# Altium project PUA.PrjPcb (part 3 of 14)

## Sheet Public_CPU_Reset_IO.SchDoc
size D
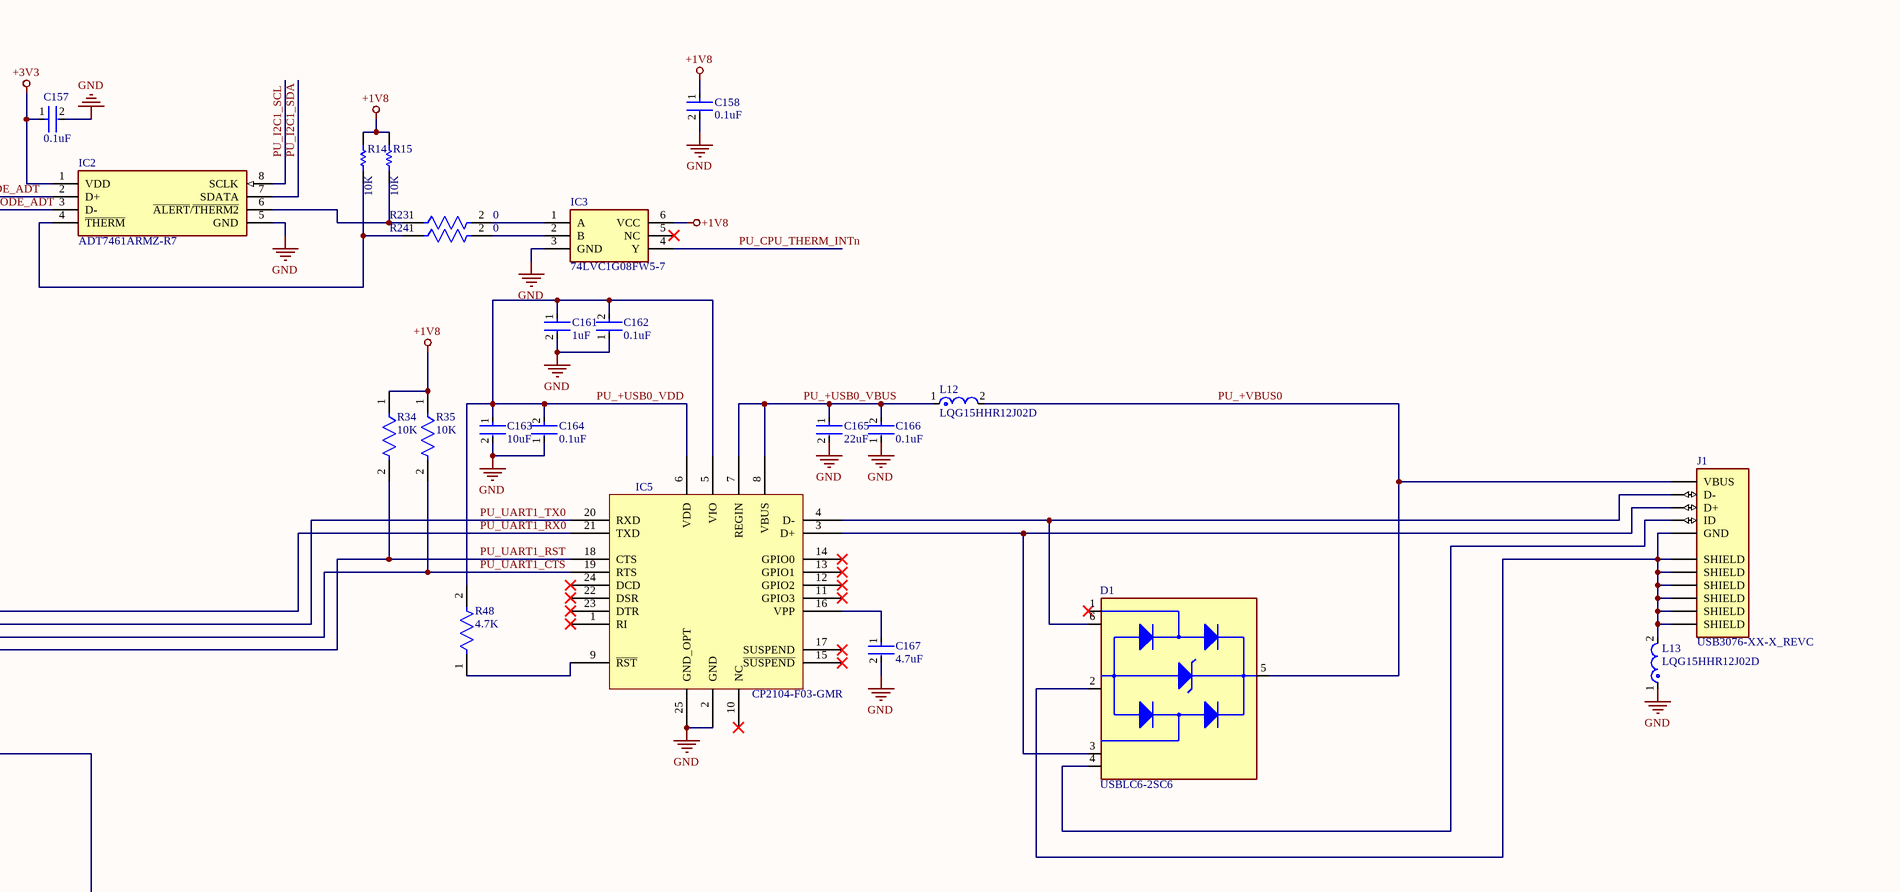
[diagram p8: Public_CPU_Reset_IO.SchDoc, top right]
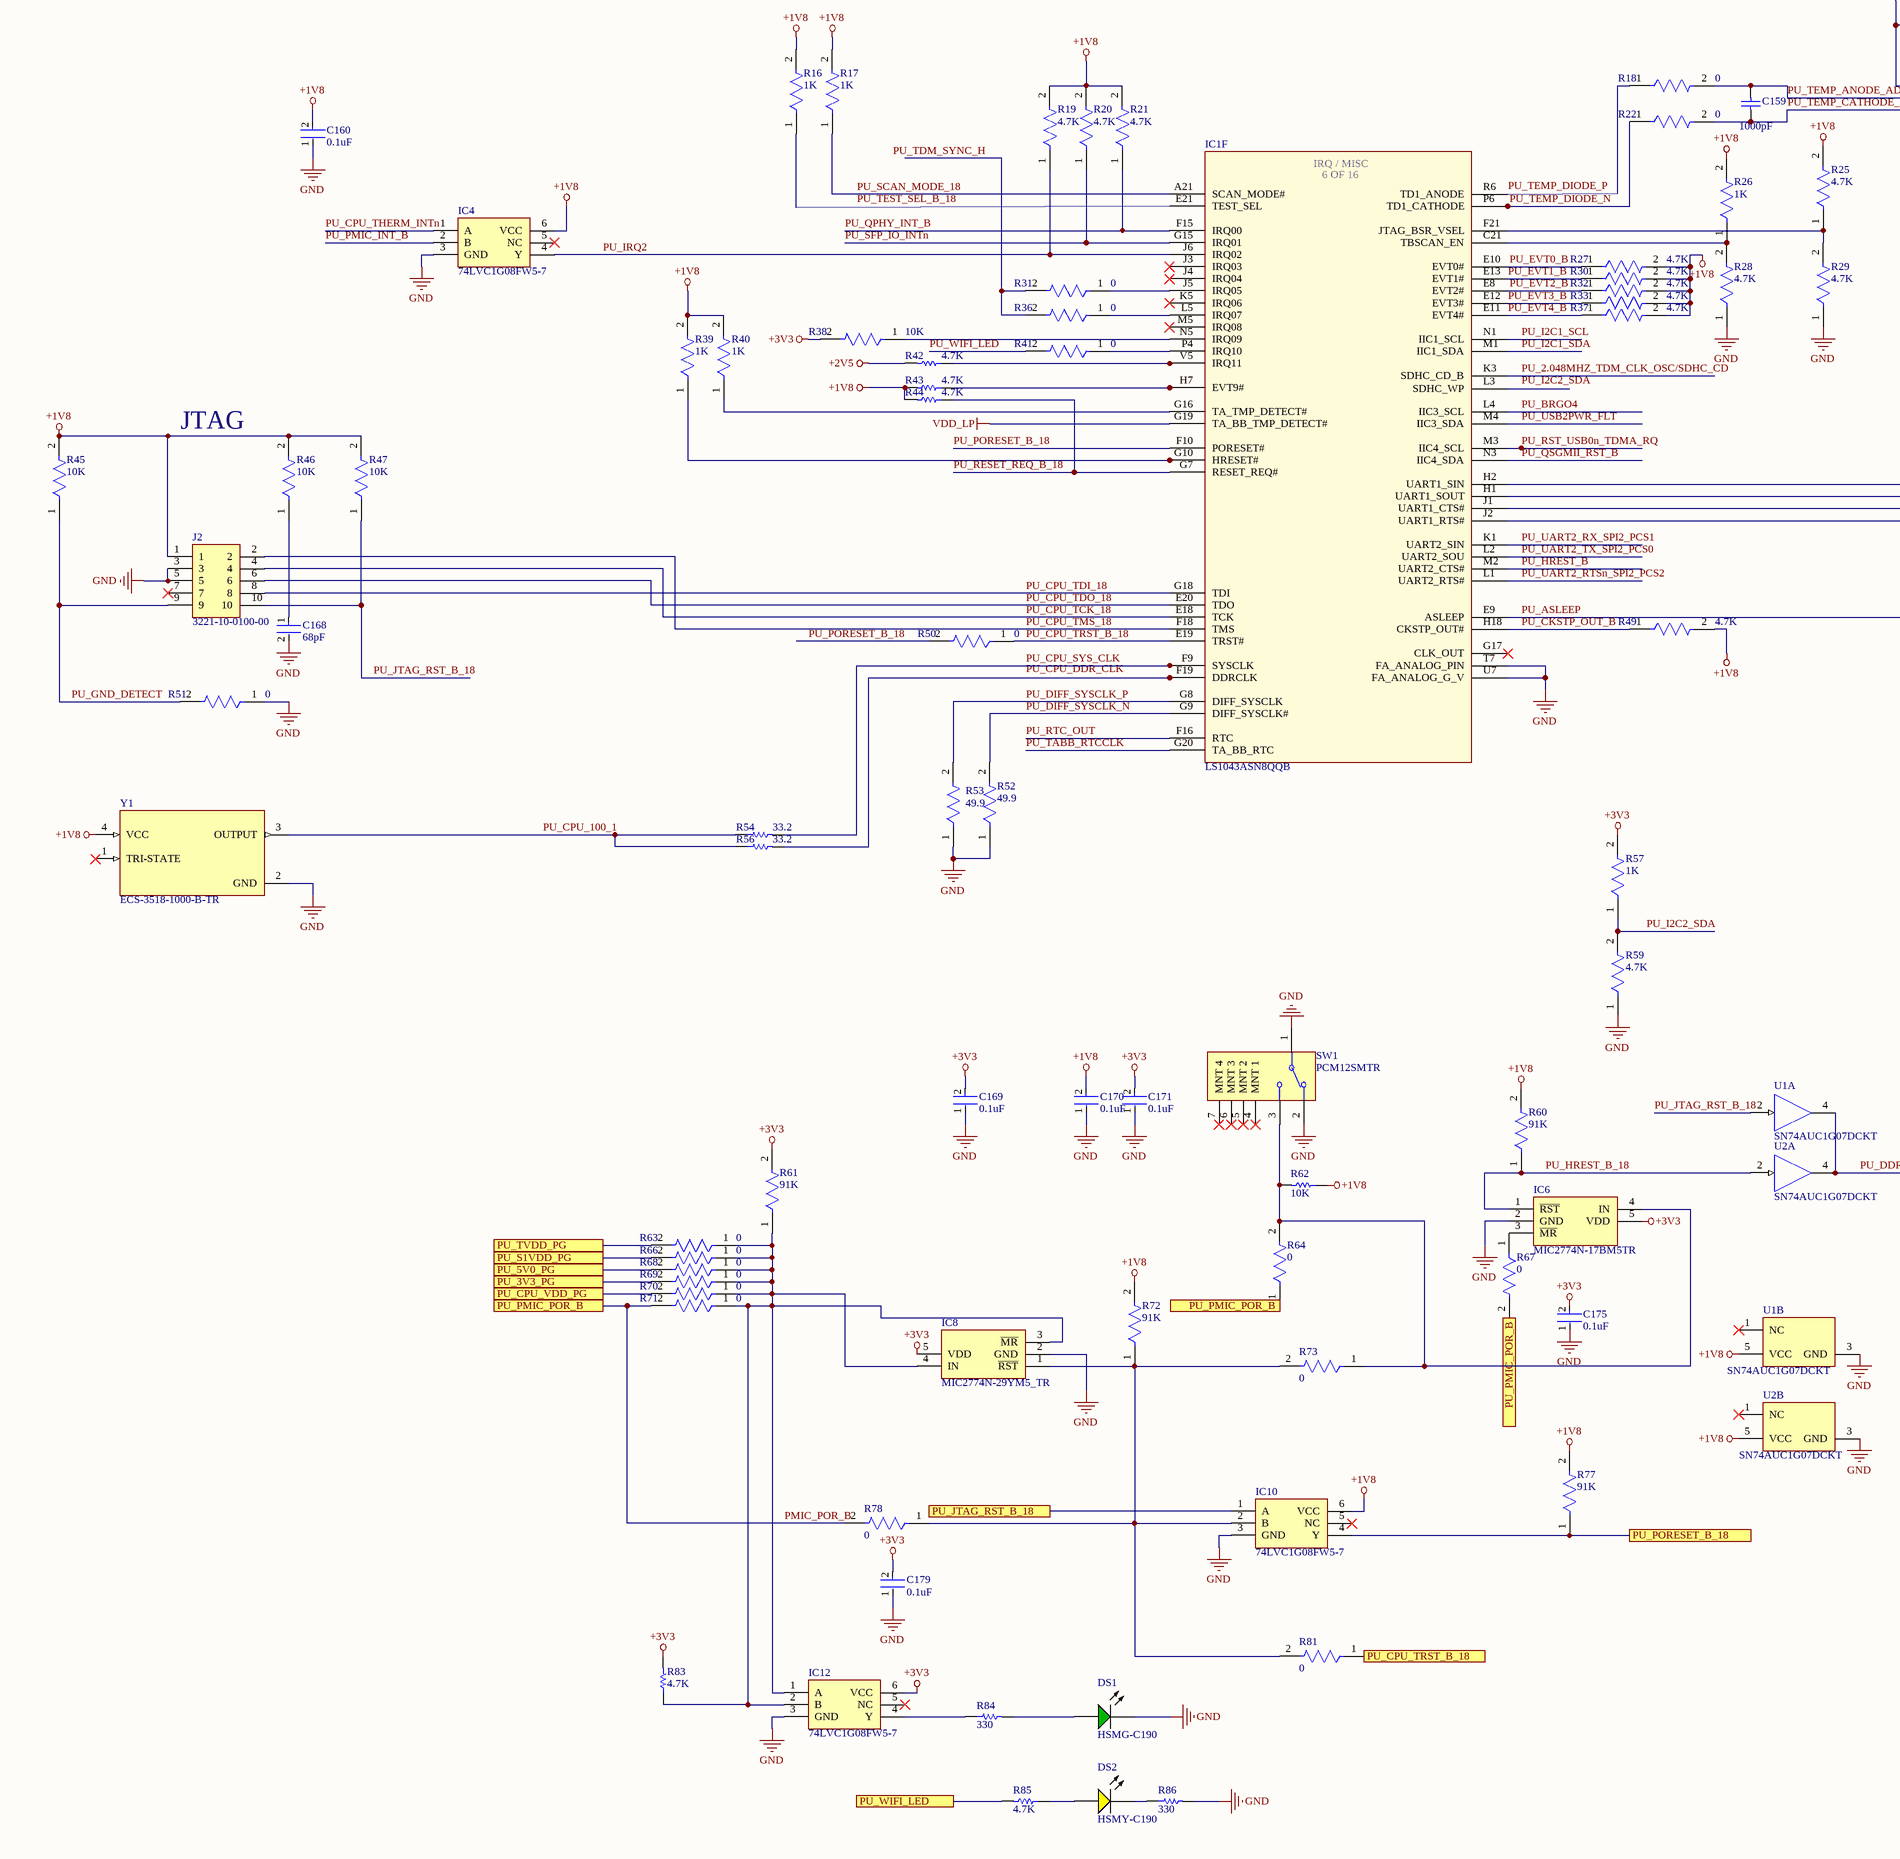
[diagram p9: Public_CPU_Reset_IO.SchDoc, bottom left]
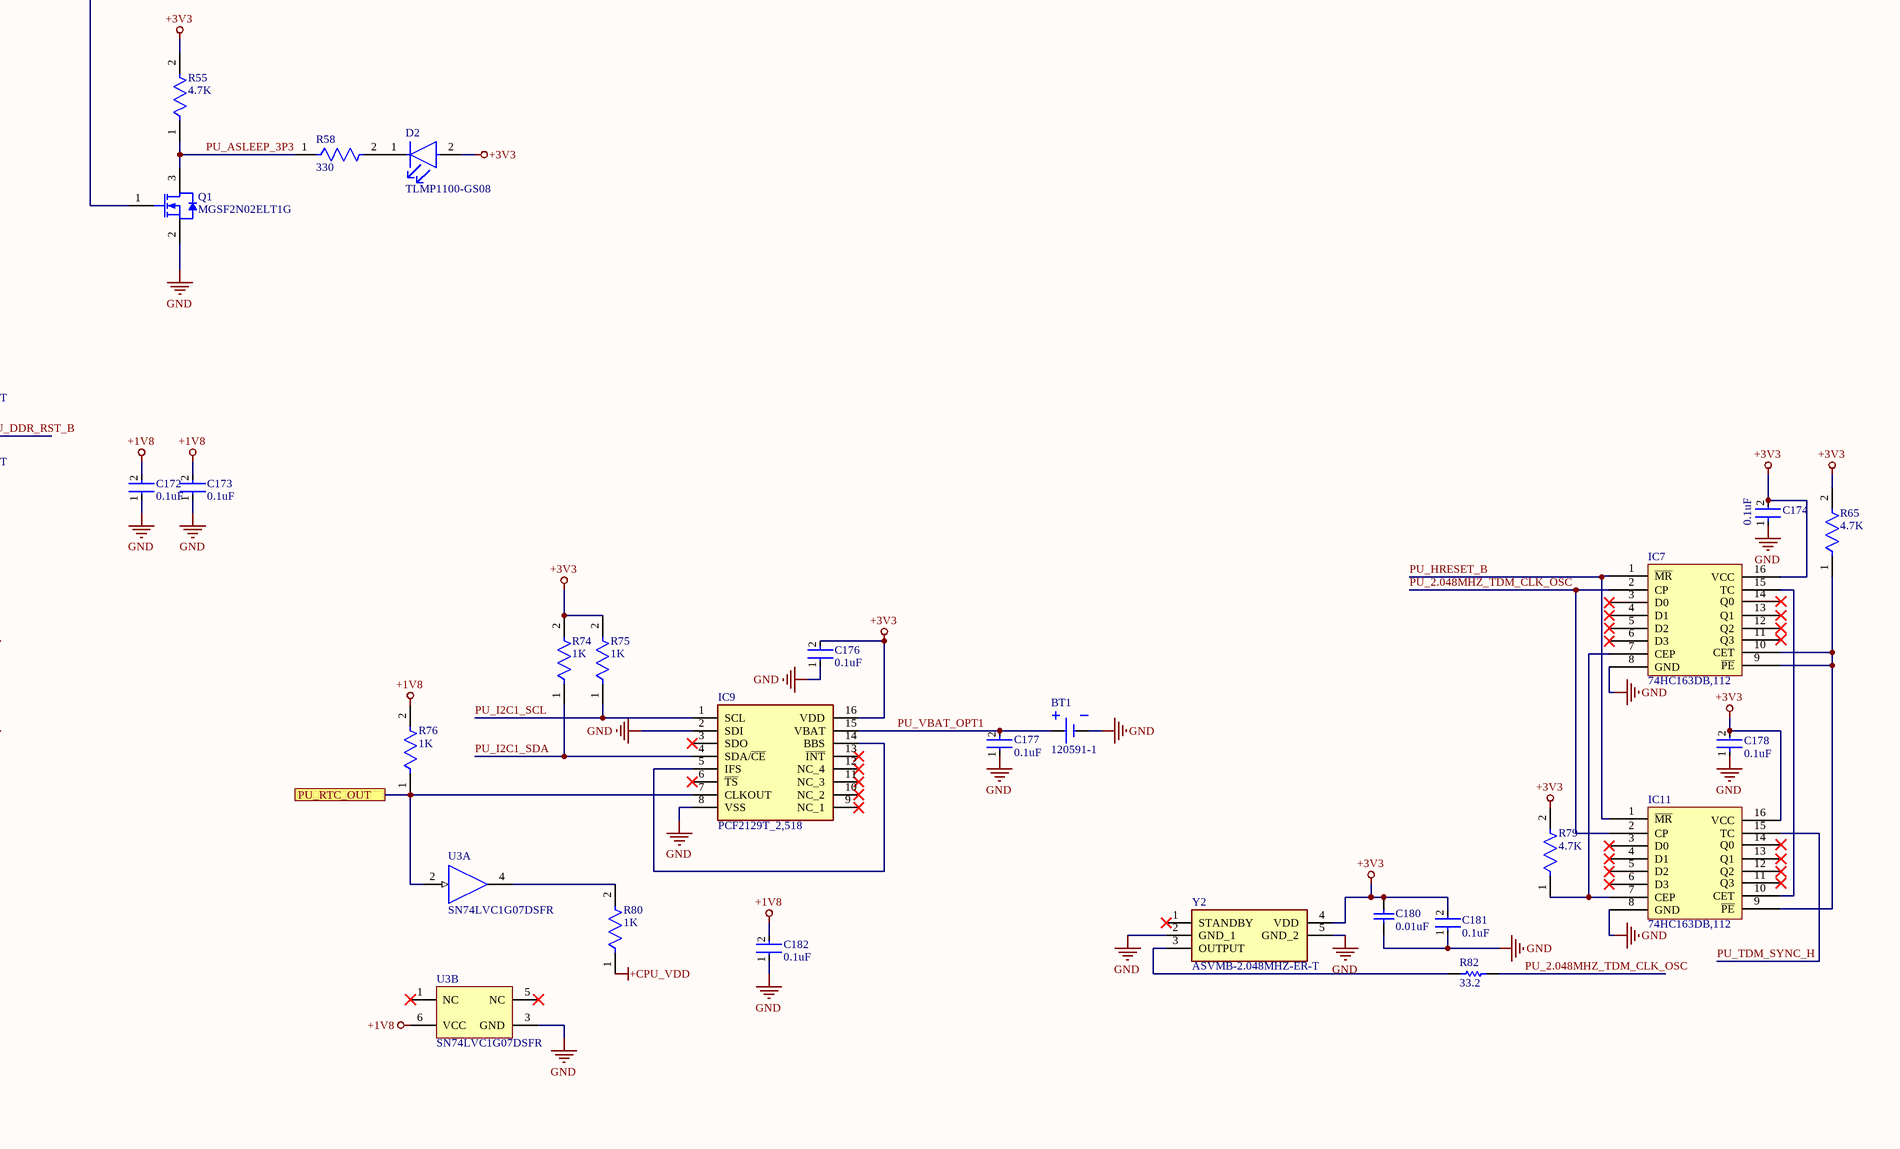
[diagram p10: Public_CPU_Reset_IO.SchDoc, bottom right]

### Parts
BT1  120591-1  [TECO-120591-1-2_V]
C157  0.1uF  [FP-C0402-BB-MFG]
C158  0.1uF  [FP-C0402-BB-MFG]
C159  1000pF  [CAPC1005X55X25ML5T10]
C160  0.1uF  [FP-GRM15-MFG]
C161  1uF  [FP-GRM15-0_1-MFG]
C162  0.1uF  [FP-GRM15-MFG]
C163  10uF  [FP-C0805C-DG-MFG]
C164  0.1uF  [FP-GRM15-MFG]
C165  22uF  [FP-GRM21B-0_15-MFG]
C166  0.1uF  [FP-GRM15-MFG]
C167  4.7uF  [FP-GRM155-0_1-IPC_B]
C168  68pF  [FP-C0805C-DN-MFG]
C169  0.1uF  [FP-GRM15-MFG]
C170  0.1uF  [FP-GRM15-MFG]
C171  0.1uF  [FP-GRM15-MFG]
C172  0.1uF  [FP-GRM15-MFG]
C173  0.1uF  [FP-GRM15-MFG]
C174  0.1uF  [FP-C0402-BB-MFG]
C175  0.1uF  [FP-GRM15-MFG]
C176  0.1uF  [FP-GRM15-MFG]
C177  0.1uF  [FP-GRM15-MFG]
C178  0.1uF  [FP-C0402-BB-MFG]
C179  0.1uF  [FP-GRM15-MFG]
C180  0.01uF  [CAPC1005X56X25LL10T15]
C181  0.1uF  [FP-C0402-BB-MFG]
C182  0.1uF  [FP-GRM15-MFG]
D1  USBLC6-2SC6  [SOT95P280X145-6N]
D2  TLMP1100-GS08  [FP-6_541-5056_01-4-MFG]
DS1  HSMG-C190  [AVAG-HSMX-C190_V]
DS2  HSMY-C190  [AVAG-HSMX-C190_V]
IC1  LS1043ASN8QQB  [BGA780C80P28X28_2300X2300X261]  (part F of 16)
IC2  ADT7461ARMZ-R7  [SOP65P490X110-8N]
IC3  74LVC1G08FW5-7  [74LVC1G08FW57]
IC4  74LVC1G08FW5-7  [74LVC1G08FW57]
IC5  CP2104-F03-GMR  [QFN50P400X400X80-25N-D]
IC6  MIC2774N-17BM5TR  [SOT95P280X145-5N]
IC7  74HC163DB,112  [SOP65P775X200-16N]
IC8  MIC2774N-29YM5_TR  [SOT95P280X145-5N]
IC9  PCF2129T_2,518  [SOIC127P1032X265-16N]
IC10  74LVC1G08FW5-7  [74LVC1G08FW57]
IC11  74HC163DB,112  [SOP65P775X200-16N]
IC12  74LVC1G08FW5-7  [74LVC1G08FW57]
J1  USB3076-XX-X_REVC  [GCT_USB3076-XX-X_REVC]
J2  3221-10-0100-00  [CNC_3221-10-0100-00]
L12  LQG15HHR12J02D  [FP-LQG15HH_02-IPC_B]
L13  LQG15HHR12J02D  [FP-LQG15HH_02-IPC_B]
Q1  MGSF2N02ELT1G  [ONSC-SOT-23-3-318-08_V]
R14  10K  [RESC1005X40X25NL05T05]
R15  10K  [RESC1005X40X25NL05T05]
R16  1K  [FP-CRCW0402-e3-MFG]
R17  1K  [FP-CRCW0402-e3-MFG]
R18  0  [FP-CRCW0402-e3-IPC_C]
R19  4.7K  [FP-CRCW0402-e3-IPC_B]
R20  4.7K  [FP-CRCW0402-e3-IPC_B]
R21  4.7K  [FP-CRCW0402-e3-IPC_B]
R22  0  [FP-CRCW0402-e3-IPC_C]
R23  0  [FP-CRCW0402-e3-IPC_C]
R24  0  [FP-CRCW0402-e3-IPC_C]
R25  4.7K  [FP-CRCW0402-e3-IPC_B]
R26  1K  [FP-CRCW0402-e3-MFG]
R27  4.7K  [FP-CRCW0402-e3-IPC_B]
R28  4.7K  [FP-CRCW0402-e3-IPC_B]
R29  4.7K  [FP-CRCW0402-e3-IPC_B]
R30  4.7K  [FP-CRCW0402-e3-IPC_B]
R31  0  [FP-CRCW0402-e3-IPC_C]
R32  4.7K  [FP-CRCW0402-e3-IPC_B]
R33  4.7K  [FP-CRCW0402-e3-IPC_B]
R34  10K  [FP-CRCW0402-e3-IPC_B]
R35  10K  [FP-CRCW0402-e3-IPC_B]
R36  0  [FP-CRCW0402-e3-IPC_C]
R37  4.7K  [FP-CRCW0402-e3-IPC_B]
R38  10K  [FP-CRCW0402-e3-IPC_B]
R39  1K  [FP-CRCW0402-e3-MFG]
R40  1K  [FP-CRCW0402-e3-MFG]
R41  0  [FP-CRCW0402-e3-IPC_C]
R42  4.7K  [RESC1005X40X25LL05T05]
R43  4.7K  [RESC1005X40X25LL05T05]
R44  4.7K  [RESC1005X40X25LL05T05]
R45  10K  [FP-CRCW0402-e3-IPC_B]
R46  10K  [FP-CRCW0402-e3-IPC_B]
R47  10K  [FP-CRCW0402-e3-IPC_B]
R48  4.7K  [FP-CRCW0402-e3-IPC_B]
R49  4.7K  [FP-CRCW0402-e3-IPC_B]
R50  0  [FP-CRCW0402-e3-IPC_C]
R51  0  [FP-CRCW0402-e3-IPC_C]
R52  49.9  [FP-CRCW0402-e3-MFG]
R53  49.9  [FP-CRCW0402-e3-MFG]
R54  33.2  [RESC1005X40X25LL05T05]
R55  4.7K  [FP-CRCW0402-e3-IPC_B]
R56  33.2  [RESC1005X40X25LL05T05]
R57  1K  [FP-CRCW0402-e3-MFG]
R58  330  [FP-CRCW0402-e3-MFG]
R59  4.7K  [FP-CRCW0402-e3-IPC_B]
R60  91K  [FP-CRCW0402-e3-IPC_B]
R61  91K  [FP-CRCW0402-e3-IPC_B]
R62  10K  [RESC1005X40X25NL05T05]
R63  0  [FP-CRCW0402-e3-IPC_C]
R64  0  [FP-CRCW0402-e3-IPC_C]
R65  4.7K  [FP-CRCW0402-e3-IPC_B]
R66  0  [FP-CRCW0402-e3-IPC_C]
R67  0  [FP-CRCW0402-e3-IPC_C]
R68  0  [FP-CRCW0402-e3-IPC_C]
R69  0  [FP-CRCW0402-e3-IPC_C]
R70  0  [FP-CRCW0402-e3-IPC_C]
R71  0  [FP-CRCW0402-e3-IPC_C]
R72  91K  [FP-CRCW0402-e3-IPC_B]
R73  0  [FP-CRCW0402-e3-IPC_C]
R74  1K  [FP-CRCW0402-e3-MFG]
R75  1K  [FP-CRCW0402-e3-MFG]
R76  1K  [FP-CRCW0402-e3-MFG]
R77  91K  [FP-CRCW0402-e3-IPC_B]
R78  0  [FP-CRCW0402-e3-IPC_C]
R79  4.7K  [FP-CRCW0402-e3-IPC_B]
R80  1K  [FP-CRCW0402-e3-MFG]
R81  0  [FP-CRCW0402-e3-IPC_C]
R82  33.2  [RESC1005X40X25ML05T05]
R83  4.7K  [RESC1005X40X25LL05T05]
R84  330  [RESC1608X55X30LL15T15]
R85  4.7K  [RESC1005X40X25LL05T05]
R86  330  [RESC1608X55X30LL15T15]
SW1  PCM12SMTR  [FP-PCM12SMTR-MFG]
U1  SN74AUC1G07DCKT  [DCK0005A_M]  (parts A,B of 2)
U2  SN74AUC1G07DCKT  [DCK0005A_M]  (parts A,B of 2)
U3  SN74LVC1G07DSFR  [DSF0006A_V]  (parts A,B of 2)
Y1  ECS-3518-1000-B-TR  [OSC_ECS-3518-1000-B-TR]
Y2  ASVMB-2.048MHZ-ER-T  [ASVMB2048MHZERT]

### Ports
PU_3V3_PG, PU_5V0_PG, PU_CPU_TRST_B_18, PU_CPU_VDD_PG, PU_JTAG_RST_B_18, PU_PMIC_POR_B, PU_PORESET_B_18, PU_RTC_OUT, PU_S1VDD_PG, PU_TVDD_PG, PU_WIFI_LED

### Nets
+1V8: C158.1 C160.2 C170.2 C172.2 C173.2 C182.2 IC3.6(VCC) IC4.6(VCC) IC10.6(VCC) J2.1 R14.2 R15.2 R16.2 R17.2 R19.2 R20.2 R21.2 R25.2 R26.2 R27.2 R30.2 R32.2 R33.2 R34.1 R35.1 R37.2 R39.2 R40.2 R43.2 R44.2 R45.2 R46.2 R47.2 R49.2 R60.2 R62.1 R72.2 R76.2 R77.2 U1.5(VCC) U2.5(VCC) U3.6(VCC) Y1.4(VCC)
+2V5: R42.2
+3V3: C157.1 C169.2 C171.2 C174.2 C175.2 C176.2 C178.2 C179.2 C180.2 C181.2 D2.2(A) IC2.1(VDD) IC6.5(VDD) IC7.16(VCC) IC8.5(VDD) IC9.16(VDD) IC11.16(VCC) IC12.6(VCC) R38.2 R55.2 R57.2 R61.2 R65.2 R74.2 R75.2 R79.2 R83.2 Y2.4(VDD)
+CPU_VDD: R80.1
GND: BT1.2(-) C157.2 C158.2 C160.1 C161.2 C162.1 C163.2 C164.1 C165.2 C166.1 C167.2 C168.2 C169.1 C170.1 C171.1 C172.1 C173.1 C174.1 C175.1 C176.1 C177.1 C178.1 C179.1 C180.1 C181.1 C182.1 DS1.2(K) IC1.T7(FA_ANALOG_PIN) IC1.U7(FA_ANALOG_G_V) IC2.5(GND) IC3.3(GND) IC4.3(GND) IC5.2(GND) IC5.25(GND_OPT) IC6.2(GND) IC7.8(GND) IC8.2(GND) IC9.2(SDI) IC9.8(VSS) IC10.3(GND) IC11.8(GND) IC12.3(GND) J2.3 J2.5 L13.1 Q1.2(S) R28.1 R29.1 R51.1 R52.1 R53.1 R59.1 R86.2 SW1.1 SW1.2 U1.3(GND) U2.3(GND) U3.3(GND) Y1.2(GND) Y2.2(GND_1) Y2.5(GND_2)
VDD_LP: IC1.G19(TA_BB_TMP_DETECT#)
PMIC_POR_B: R64.1 R67.2 R71.2 R78.2 ; port PU_PMIC_POR_B
PU_2.048MHZ_TDM_CLK_OSC: IC7.2(CP) IC11.2(CP) R82.2
PU_2.048MHZ_TDM_CLK_OSC/SDHC_CD: IC1.K3(SDHC_CD_B)
PU_+USB0_VBUS: C165.1 C166.2 IC5.7(REGIN) IC5.8(VBUS) L12.1
PU_+USB0_VDD: C161.1 C162.2 C163.1 C164.2 IC5.5(VIO) IC5.6(VDD) R48.2
PU_+VBUS0: D1.5(VBUS) J1.1(VBUS) L12.2
PU_ASLEEP: IC1.E9(ASLEEP) Q1.1(G)
PU_ASLEEP_3P3: Q1.3(D) R55.1 R58.1
PU_BRGO4: IC1.L4(IIC3_SCL)
PU_CKSTP_OUT_B: IC1.H18(CKSTP_OUT#) R49.1
PU_CPU_100_1: R54.1 R56.1 Y1.3(OUTPUT)
PU_CPU_SYS_CLK: IC1.F9(SYSCLK) R54.2
PU_CPU_TCK_18: IC1.E18(TCK) J2.4
PU_CPU_TDI_18: IC1.G18(TDI) J2.8
PU_CPU_TDO_18: IC1.E20(TDO) J2.6
PU_CPU_THERM_INTn: IC3.4(Y) IC4.1(A)
PU_CPU_TMS_18: IC1.F18(TMS) J2.2
PU_CPU_TRST_B_18: IC1.E19(TRST#) R50.1
PU_DDR_RST_B: U1.4(Y) U2.4(Y)
PU_DIFF_SYSCLK_N: IC1.G9(DIFF_SYSCLK#) R52.2
PU_DIFF_SYSCLK_P: IC1.G8(DIFF_SYSCLK) R53.2
PU_EVT0_B: IC1.E10(EVT0#) R27.1
PU_EVT1_B: IC1.E13(EVT1#) R30.1
PU_EVT2_B: IC1.E8(EVT2#) R32.1
PU_EVT3_B: IC1.E12(EVT3#) R33.1
PU_EVT4_B: IC1.E11(EVT4#) R37.1
PU_GND_DETECT: J2.9 R45.1 R51.2
PU_HRESET_B: IC7.1(~{MR}) IC11.1(~{MR})
PU_HREST_B: IC1.M2(UART2_CTS#)
PU_HREST_B_18: IC6.1(~{RST}) R60.1 U2.2(A)
PU_I2C1_SCL: IC1.N1(IIC1_SCL) IC2.8(SCLK) IC9.1(SCL) R75.1
PU_I2C1_SDA: IC1.M1(IIC1_SDA) IC2.7(SDATA) IC9.4(SDA/~{CE}) R74.1
PU_I2C2_SDA: R57.1 R59.2
PU_IRQ2: IC1.J6(IRQ02) IC4.4(Y) R19.1
PU_JTAG_RST_B_18: J2.10 R47.1 U1.2(A)
PU_PMIC_INT_B: IC4.2(B)
PU_PORESET_B_18: IC1.F10(PORESET#) R50.2
PU_QPHY_INT_B: IC1.F15(IRQ00) R21.1
PU_QSGMII_RST_B: IC1.N3(IIC4_SDA)
PU_RESET_REQ_B_18: IC1.G7(RESET_REQ#) R44.1
PU_RST_USB0n_TDMA_RQ: IC1.M3(IIC4_SCL)
PU_RTC_OUT: IC1.F16(RTC)
PU_SCAN_MODE_18: IC1.A21(SCAN_MODE#) R17.1
PU_SFP_IO_INTn: IC1.G15(IRQ01) R20.1
PU_TABB_RTCCLK: IC1.G20(TA_BB_RTC)
PU_TDM_SYNC_H: IC11.15(TC)
PU_TEMP_ANODE_ADT: C159.2 IC2.2(D+) R18.2
PU_TEMP_CATHODE_ADT: C159.1 IC2.3(D-) R22.2
PU_TEMP_DIODE_N: IC1.P6(TD1_CATHODE) R22.1
PU_UART1_CTS: IC1.J1(UART1_CTS#) IC5.19(RTS) R35.2
PU_UART1_RST: IC1.J2(UART1_RTS#) IC5.18(CTS) R34.2
PU_UART1_RX0: IC1.H2(UART1_SIN) IC5.21(TXD)
PU_UART1_TX0: IC1.H1(UART1_SOUT) IC5.20(RXD)
PU_UART2_RTSn_SPI2_PCS2: IC1.L1(UART2_RTS#)
PU_UART2_RX_SPI2_PCS1: IC1.K1(UART2_SIN)
PU_UART2_TX_SPI2_PCS0: IC1.L2(UART2_SOU)
PU_USB2PWR_FLT: IC1.M4(IIC3_SDA)
PU_VBAT_OPT1: BT1.1(+) C177.2 IC9.15(VBAT)
PU_WIFI_LED: R41.2
NetC167_1: C167.1 IC5.16(VPP)
NetC168_1: C168.1 R46.1
NetD1_2: D1.2(GND) J1.5(GND) J1.6(SHIELD) J1.7(SHIELD) J1.8(SHIELD) J1.9(SHIELD) J1.10(SHIELD) J1.11(SHIELD) L13.2
NetD1_3: D1.3(I/O2) IC5.3(D+) J1.3(D+)
NetD1_4: D1.4(I/O2) J1.4(ID)
NetD1_6: D1.6(I/O1) IC5.4(D-) J1.2(D-)
NetD2_1: D2.1(C) R58.2
NetDS1_1: DS1.1(A) R84.2
NetDS2_1: DS2.1(A) R85.1
NetDS2_2: DS2.2(K) R86.1
NetIC1_C21: IC1.C21(TBSCAN_EN) R26.1 R28.2
NetIC1_E21: IC1.E21(TEST_SEL) R16.1
NetIC1_F19: IC1.F19(DDRCLK) R56.2
NetIC1_F21: IC1.F21(JTAG_BSR_VSEL) R25.1 R29.2
NetIC1_G10: IC1.G10(HRESET#) R39.1
NetIC1_G16: IC1.G16(TA_TMP_DETECT#) R40.1
NetIC1_H7: IC1.H7(EVT9#) R43.1
NetIC1_J5: IC1.J5(IRQ05) R31.1
NetIC1_L5: IC1.L5(IRQ07) R36.1
NetIC1_N5: IC1.N5(IRQ09) R38.1
NetIC1_P4: IC1.P4(IRQ10) R41.1
NetIC1_R6: IC1.R6(TD1_ANODE) R18.1
NetIC1_V5: IC1.V5(IRQ11) R42.1
NetIC2_4: IC2.4(~{THERM}) R14.1 R24.1
NetIC2_6: IC2.6(~{ALERT}/~{THERM2}) R15.1 R23.1
NetIC3_1: IC3.1(A) R23.2
NetIC3_2: IC3.2(B) R24.2
NetIC5_9: IC5.9(~{RST}) R48.1
NetIC6_3: IC6.3(~{MR}) R67.1
NetIC6_4: IC6.4(IN) R62.2 R64.2 R73.1 SW1.3
NetIC7_7: IC7.7(CEP) IC11.7(CEP) R79.1
NetIC7_9: IC7.9(~{PE}) IC7.10(CET) IC11.9(~{PE}) R65.1
NetIC7_15: IC7.15(TC) IC11.10(CET)
NetIC8_1: IC8.1(~{RST}) IC10.2(B) R72.1 R73.2 R78.1 R81.2
NetIC8_3: IC8.3(~{MR}) IC8.4(IN) IC12.1(A) IC12.2(B) R61.1 R63.1 R66.1 R68.1 R69.1 R70.1 R71.1 R83.1
NetIC9_5: IC9.5(IFS) IC9.14(BBS)
NetIC9_7: IC9.7(CLKOUT) R76.1 U3.2(A) ; port PU_RTC_OUT
NetIC10_1: IC10.1(A) ; port PU_JTAG_RST_B_18
NetIC10_4: IC10.4(Y) R77.1 ; port PU_PORESET_B_18
NetIC12_4: IC12.4(Y) R84.1
NetR31_2: R31.2 R36.2
NetR63_2: R63.2 ; port PU_TVDD_PG
NetR66_2: R66.2 ; port PU_S1VDD_PG
NetR68_2: R68.2 ; port PU_5V0_PG
NetR69_2: R69.2 ; port PU_3V3_PG
NetR70_2: R70.2 ; port PU_CPU_VDD_PG
NetR80_2: R80.2 U3.4(Y)
NetR81_1: R81.1 ; port PU_CPU_TRST_B_18
NetR82_1: R82.1 Y2.3(OUTPUT)
NetR85_2: R85.2 ; port PU_WIFI_LED

Not connected (* = marked no-connect by the designer): D1 1(I/O1)*; IC1 G17(CLK_OUT)* J3(IRQ03)* J4(IRQ04)* K5(IRQ06)* L3(SDHC_WP) M5(IRQ08)*; IC3 5(NC)*; IC4 5(NC)*; IC5 1(RI)* 10(NC)* 11(GPIO3)* 12(GPIO2)* 13(GPIO1)* 14(GPIO0)* 15(~{SUSPEND})* 17(SUSPEND)* 22(DSR)* 23(DTR)* 24(DCD)*; IC7 3(D0)* 4(D1)* 5(D2)* 6(D3)* 11(Q3)* 12(Q2)* 13(Q1)* 14(Q0)*; IC9 3(SDO)* 6(~{TS})* 9(NC_1)* 10(NC_2)* 11(NC_3)* 12(NC_4)* 13(~{INT})*; IC10 5(NC)*; IC11 3(D0)* 4(D1)* 5(D2)* 6(D3)* 11(Q3)* 12(Q2)* 13(Q1)* 14(Q0)*; IC12 5(NC)*; J2 7*; SW1 4(MNT_1)* 5(MNT_2)* 6(MNT_3)* 7(MNT_4)*; U1 1(NC)*; U2 1(NC)*; U3 1(NC)* 5(NC)*; Y1 1(TRI-STATE)*; Y2 1(STANDBY)*

### Notes on the sheet
- JTAG
- Labels drawn without touching a wire or pin: PU_CPU_DDR_CLK, PU_I2C2_SDA, PU_TDM_SYNC_H, PU_TEMP_DIODE_P, PU_TEST_SEL_B_18
- Title
- Size:
- Date:
- File:
- D
- Number:
- Time:
- Revision:
- Sheet
- of
- (in symbol LS1043ASN8QQB, part F) IRQ / MISC; 6 OF 16

### Library data of the parts
BT1 = CMP-0438-00001-2: Lithium Battery Holder for CR2032 3V Cell; Manufacturer: TE Connectivity; Packing Type: Tray; Body Shape: Horizontal Cylindrical; AccessRights: 2147483647; RevisionId: 1; Folder: Unified Components\Components\TE Connectivity\Connectors & Connector Components\Power Products\Battery Interconnection Products\; ContentType: Unified Component; ContentTypeGUID: CB3C11C4-E317-11DF-B822-12313F0024A2; ComponentLink1Description: Manufacturer URL; LifeCycleStateGUID: 61E382EE-6656-4F12-9E24-BE9327104A25; FolderGUID: A6761B51-D489-48A3-9180-F4808F45AB79; PartNumber: 120591-1; LifeCycle: Released; ReleaseDate: 20/08/2013 02:50:22 AM; PackageReference: 120591-1; ComponentLink2URL: http://www.te.com/commerce/DocumentDelivery/DDEController?Action=showdoc&DocId=Customer+Drawing%7F120591%7FH%7Fpdf%7FEnglish%7FENG_CD_120591_H.pdf%7F120591-1; DatasheetVersion: Rev. H, 01/2013; PackageDescription: Lithium Battery Holder; ItemGUID: B2C50140-681E-4F62-8DBB-9728605318CE; ItemHRID: CMP-0438-00001; Mounting Technology: Through Hole; ComponentLink1URL: http://www.te.com/; ComponentLink2Description: Datasheet
C157 C158 C174 C178 C181 = CMP-2008-02046-2: CAP CER 0.1UF 10V X5R 0402; Manufacturer: Kemet; Manufacturer Part Number: C0402C104K8PACTU; Material: Ceramic; Capacitance: 0.10 μF; Temperature Coefficient: 15%; Tolerance: 0.1; Value: 0.10 μF; Package: C0402-BB; Temperature: -55°C to +125°C; ComponentLink2Description: Datasheet; Temperature Characteristic: X5R; Device Class L1: Passive Components; Height: 0.55mm; Lead Free: Yes; ComponentLink2URL: https://content.kemet.com/datasheets/KEM_C1002_X7R_SMD.pdf; Device Class L2: Capacitors; Temperature Range Low: -55°C; Temperature Range High: +125°C; RoHS: TRUE; Octopart: https://octopart.com/c0402c104k8pactu-kemet-140039; Automotive: No; Mouser Description: Capacitor 100 nF 10 VDC 0402; Category: Cap; Voltage Rating: 10 V; Digikey Description: CAP CER 0.1UF 10V X5R 0402; Ipc Land Pattern Name: CAPC10050X50; Device Class L3: Ceramic Capacitors
C159 = CMP-1662-00017-1: Chip Capacitor, 1 nF, +/- 10%, 50 V, -55 to 125 degC, 0402 (1005 Metric), RoHS, Tape and Reel; Case\/Package: 0402; Type (Capacitors): X7R; Voltage Rating (DC): 50 V; Capacitance: 1 nF; Width: 0.5 mm; Pins: 2; REACH SVHC: No SVHC; Length: 1 mm; Height: 0.5 mm; PackageDescription: 2-Pin Surface Mount Device, Body 1 x 0.5 mm; DatasheetVersion: 07/2016; Mount: Surface Mount; ComponentLink2Description: Datasheet; Tolerance: 10%; ComponentLink2URL: http://psearch.en.murata.com/capacitor/product/GRM155R71H102KA01%23.pdf; ComponentLink1URL: http://www.murata.com/; Case Code (Metric): 1005; Package Quantity: 10000; Min Operating Temperature: -55 degC; Max Operating Temperature: 125 degC; Voltage Rating: 50 V; ComponentLink1Description: Manufacturer URL; Packaging: Tape and Reel; Radiation Hardening: No; RoHSCompliant: true; PackageReference: 0402; Mounting Technology: Surface Mount; Case Code (Imperial): 0402
C160 C162 C164 C166 C169-C173 C175-C177 C179 C182 = CMP-2100-03641-2: CAP CER 0.1UF 16V X7R 0402; Manufacturer Part Number: GRM155R71C104KA88D; Manufacturer: Murata; Standoff Height: 0mm; Tolerance: 10%; Voltage Rating: 16Vdc; Material: Ceramic; Capacitance: 0.10μF; Value: 0.10μF; RoHS: TRUE; Temperature Characteristic: X7R; Octopart: https://octopart.com/grm155r71c104ka88d-murata-196880; Digikey Description: CAP CER 0.1UF 16V X7R 0402; Device Class L3: Ceramic Capacitors; Height: 0.55mm; ComponentLink2Description: Datasheet; Temperature Range Low: -55°C; Ipc Land Pattern Name: CAPC10050X219; ComponentLink2URL: https://search.murata.co.jp/Ceramy/image/img/A01X/G101/ENG/GRM155R71H471KA01-01A.pdf; Device Class L1: Passive Components; Lead Free: yes; Category: Cap; Package: GRM15; Temperature: -55°C to +125°C; Device Class L2: Capacitors; Temperature Range High: +125°C; Mouser Description: 0402 0.1 uF 16V ±10 % Tolerance X7R SMT Multilayer Ceramic Capacitor
C161 = CMP-2008-04556-2: CAP CER 1UF 10V X5R 0402; Manufacturer Part Number: GRM155R61A105KE15D; Manufacturer: Murata; Material: Ceramic; Tolerance: 10%; Temperature Coefficient: 15%; Octopart: https://octopart.com/grm155r61a105ke15d-murata-197442; Lead Free: Yes; ComponentLink2Description: Datasheet; Temperature: -55°C to +85°C; Temperature Range High: +85°C; Height: 0.55mm; Capacitance: 1uF; Ipc Land Pattern Name: CAPC10050X50; ComponentLink2URL: https://search.murata.co.jp/Ceramy/image/img/A01X/G101/ENG/GRM155R61A105KE15-01A.pdf; Temperature Range Low: -55°C; Device Class L2: Capacitors; Voltage Rating: 10V; RoHS: TRUE; Device Class L1: Passive Components; Device Class L3: Ceramic Capacitors; Temperature Characteristic: X5R; Mouser Description: 0402 1 uF 10 V ±10% Tolerance X5R Surface Mount Multilayer Ceramic Capacitor; Automotive: No; Package: GRM15-0.1; Digikey Description: CAP CER 1UF 10V X5R 0402; Value: 1uF; Category: Cap
C163 = CMP-2007-03243-2: CAP CER 10UF 10V X5R 0805; Manufacturer Part Number: C0805C106K8PACTU; Manufacturer: Kemet; 3DS Part Number: 220-00001; Tolerance: 10%; Temperature Coefficient: 15%; Material: Ceramic; Device Class L2: Capacitors; Device Class L1: Passive Components; ComponentLink2URL: https://content.kemet.com/datasheets/KEM_C1006_X5R_SMD.pdf; Height: 1.4mm; Lead Free: Yes; Digikey Description: CAP CER 10UF 10V X5R 0805; Octopart: https://octopart.com/c0805c106k8pactu-kemet-98697; Capacitance: 10uF; Value: 10uF; Temperature Range Low: -55°C; Temperature: -55°C to +85°C; Automotive: No; Mouser Description: CAP CER 10UF 10V X5R 0805; Ipc Land Pattern Name: CAPC200125X125; Temperature Range High: +85°C; Voltage: 10V; RoHS: TRUE; Device Class L3: Ceramic Capacitors; ComponentLink2Description: Datasheet; Voltage Rating: 10V; Package: C0805C-DG; Temperature Characteristic: X5R; Category: Cap
C165 = CMP-2007-03385-2: Chip Multilayer Ceramic Capacitors for General Purpose, 0805, 22uF, X5R, 15%, 20%, 6.3V; Material: Ceramic; Max Operating Temperature: 85°C; Voltage: 6.3V; Min Operating Temperature: -55°C; Case/Package: 0805; Thickness: 0.053inch; Dielectric: X5R; Packaging: Tape and Reel; Depth: 1.25mm; Termination: SMD/SMT; Voltage Rating (DC): 6.3V; Radiation Hardening: No; Tolerance: 20%; Mount: Surface Mount; Lead Free: Lead Free; Package Quantity: 1; REACH SVHC: No SVHC; Voltage Rating: 6.3V; Capacitance: 22uF; Length: 2mm; Case Code (Imperial): 0805; Case Code (Metric): 2012; Width: 0.049inch; Height: 1.25mm
C167 = CMP-2008-04549-2: Chip Multilayer Ceramic Capacitors for General Purpose, 0402, 4.7uF, X5R, 15%, 20%, 6.3V; Height: 0.5mm; Weight: 0.000212oz; Length: 1mm; Case Code (Metric): 1005; Packaging: Tape and Reel; Termination: SMD/SMT; Dielectric: X5R; Depth: 0.5mm; Case Code (Imperial): 0402; Min Operating Temperature: -55°C; Case/Package: 0402; Voltage: 6.3V; Width: 0.02inch; Capacitance: 4.7uF; Lead Free: Lead Free; Thickness: 0.022inch; Contact Plating: Tin; REACH SVHC: No SVHC; Package Quantity: 10000; Tolerance: 20%; Voltage Rating (DC): 6.3V; Voltage Rating: 6.3V; Mount: Surface Mount; Max Operating Temperature: 85°C
C168 = CMP-2007-00438-2: CAP CER 68PF 50V C0G/NP0 0805; Manufacturer Part Number: C0805C680J5GACTU; Manufacturer: KEMET; Temperature Coefficient: 30ppm/°C; Tolerance: 0.05; Temperature Characteristic: C0G; Material: Ceramic; ComponentLink2URL: https://content.kemet.com/datasheets/KEM_C1003_C0G_SMD.pdf; Device Class L1: Passive Components; Device Class L2: Capacitors; Capacitance: 68 pF; Value: 68 pF; Category: Cap; Octopart: https://octopart.com/c0805c680j5gactu-kemet-130145; Digikey Description: CAP CER 68PF 50V C0G/NP0 0805; Voltage Rating: 50 V; Ipc Land Pattern Name: CAPC200125X78; Lead Free: Yes; RoHS: TRUE; Device Class L3: Ceramic Capacitors; Mouser Description: Multilayer Ceramic Capacitors MLCC - SMD/SMT 50volts 68pF C0G 5%; Temperature Range High: +125°C; Temperature Range Low: -55°C; Height: 0.88mm; Temperature: -55°C to +125°C; ComponentLink2Description: Datasheet; Automotive: No; Package: C0805C-DN
C180 = CMP-2008-02796-1: Manufacturer: AVX Interconnect / Elco; Part Number: 0402YC103JAT2A
D1 = USBLC6-2SC6: 17V Clamp 5A (8/20Âµs) Ipp Tvs Diode Surface Mount SOT-23-6; MF: {'manufacturer': u'STMicroelectronics'}; Availability: Unavailable; Value: *; Package: None; MP: USBLC6-2SC6; Price: None
D2 = CMP-02520-000009-1: LED GREEN 0603 SMD; Manufacturer: Vishay; Max Junction Temp: +120°C; Automotive Grade: Grade 3; Reverse Voltage: 6V; Led Orientation: Top View; Forward Voltage: 2.1V; Luminous Intensity: 15mcd; Forward Current: 20mA; Colour: Pure green; Peak Emmision Wavelength: 562nm; Wavelength: 561nm; Viewing Angle: 160°; Power Dissipation: 90mW; Digikey Description: LED GREEN 0603 SMD; Package: 6.541-5056.01-4; Ambient Temperature Range High: +100°C; Height: 0.65mm; Device Class L1: Optoelectronics; Device Class L2: LEDs; Mouser Description: Standard LEDs - SMD Pure Green; Temperature Range High: +120°C; RoHS: TRUE; Ambient Temperature Range Low: -40°C; Temperature: to +120°C; Manufacturer Part Number: TLMP1100-GS08; ComponentLink2URL: http://www.vishay.com/docs/83173/tlmb1100.pdf; Lead Free: Yes; Octopart: https://octopart.com/tlmp1100-gs08-vishay-55433993; Automotive: Yes; Device Class L3: unset; ComponentLink2Description: Datasheet; Category: Diode
DS1 = CMP-1744-00002-1: Chip LED, Green, 2.2 V, -40 to 85 degC, 2-Pin SMD, RoHS, Tape and Reel; Frequency: 400 KHz; Max Supply Voltage: 5.5 V; Access Time: 3500 ns; Clock Frequency: 100 KHz; Case\Package: SOIC; Density: 32 kb; Nominal Supply Current: 2 mA; Interface: Serial; Min Supply Voltage: 1.7 V; Packaging: Tape and Reel; PackageReference: HSMX-C190; ComponentLink2URL: http://docs.avagotech.com/docs/AV02-0551EN; RoHSCompliant: true; Pins: 8; REACH SVHC: No SVHC; Max Operating Temperature: 85 degC; Width: 4 mm; Radiation Hardening: No; Package Quantity: 3000; ComponentLink3Description: Package Specification; ComponentLink1Description: Manufacturer URL; Min Operating Temperature: -40 degC; PackageDescription: 2-Pin Surface Mount Device, Body 1.6 x 0.8 mm, Height 0.9 mm; Max Clock Frequency: 100 KHz; Height: 1.5 mm; ComponentLink1URL: http://www.avagotech.com/; DatasheetVersion: Mar-12; ComponentLink2Description: Datasheet; Mount: Surface Mount; Length: 5 mm; ComponentLink3URL: http://www.fairchildsemi.com/dwg/MA/MA03D.pdf
DS2 = CMP-1744-00003-1: LED Uni-Color Yellow, 65 mW, 20 mA, -40 to 85 degC, 2-Pin SMD, RoHS, Tape and Reel; Tolerance: 1%; Voltage Rating: 50 V; Power Rating: 100 mW; Case\Package: 0603; Resistance: 390 Ohm; Min Operating Temperature: -55 degC; Length: 1.6 mm; ComponentLink3Description: Package Specification; Mount: Surface Mount; PackageReference: HSMX-C190; ComponentLink2Description: Datasheet; DatasheetVersion: Mar-12; Case Code (Metric): 1608; Pins: 2; Package Quantity: 5000; ComponentLink2URL: http://docs.avagotech.com/docs/AV02-0551EN; ComponentLink1Description: Manufacturer URL; RoHSCompliant: true; Packaging: Tape and Reel; PackageDescription: 2-Pin Surface Mount Device, Body 1.6 x 0.8 mm, Height 0.9 mm; REACH SVHC: No SVHC; ComponentLink3URL: http://www.fairchildsemi.com/dwg/MA/MA03D.pdf; Voltage Rating (DC): 50 V; Width: 0.8 mm; ComponentLink1URL: http://www.avagotech.com/; Max Operating Temperature: 155 degC; Case Code (Imperial): 0603; Height: 0.45 mm
IC1 = LS1043ASN8QQB: Integrated Circuit; Manufacturer_Name: NXP; Datasheet Link: http://www.nxp.com/secured/assets/documents/en/data-sheet/LS1088A.pdf; Height: 2.61mm; Manufacturer_Part_Number: LS1043ASN8QQB; Mouser Part Number: 771-LS1043ASN8QQB; Mouser Price/Stock: https://www.mouser.co.uk/ProductDetail/NXP-Semiconductors/LS1043ASN8QQB/?qs=AQlKX63v8RsTATOTx7X0Jg%3D%3D
IC2 = ADT7461ARMZ-R7: Integrated Circuit; Manufacturer_Name: ON Semiconductor; Datasheet Link: http://www.onsemi.com/pub/Collateral/ADT7461-D.PDF; Height: 1.1mm; Manufacturer_Part_Number: ADT7461ARMZ-R7; Mouser Part Number: 863-ADT7461ARMZ-R7; Mouser Price/Stock: https://www.mouser.co.uk/ProductDetail/ON-Semiconductor/ADT7461ARMZ-R7/?qs=t2BMfLoP1KTcbdCoNjA9Gw%3D%3D; Arrow Part Number: ADT7461ARMZ-R7; Arrow Price/Stock: https://www.arrow.com/en/products/adt7461armz-r7/on-semiconductor
IC3 IC4 IC10 IC12 = 74LVC1G08FW5-7: Integrated Circuit; Manufacturer_Name: Diodes Inc.; Datasheet Link: https://www.diodes.com/assets/Datasheets/74LVC1G08.pdf; Height: 0.5mm; Manufacturer_Part_Number: 74LVC1G08FW5-7; Mouser Part Number: 621-74LVC1G08FW5-7; Mouser Price/Stock: https://www.mouser.co.uk/ProductDetail/Diodes-Incorporated/74LVC1G08FW5-7?qs=mYAa4mSiDJyHmkX79TXrAg%3D%3D; Arrow Part Number: 74LVC1G08FW5-7; Arrow Price/Stock: https://www.arrow.com/en/products/74lvc1g08fw5-7/diodes-incorporated
IC5 = CP2104-F03-GMR: Integrated Circuit; Manufacturer_Name: Silicon Labs; Datasheet Link: https://www.silabs.com/documents/public/data-sheets/cp2104.pdf; Height: 0.8mm; Manufacturer_Part_Number: CP2104-F03-GMR; Mouser Part Number: 634-CP2104-F03-GMR; Mouser Price/Stock: https://www.mouser.co.uk/ProductDetail/Silicon-Labs/CP2104-F03-GMR?qs=1CB38rTTsYrRJKVkczeRzA%3D%3D; Arrow Part Number: CP2104-F03-GMR; Arrow Price/Stock: https://www.arrow.com/en/products/cp2104-f03-gmr/silicon-labs
IC6 = MIC2774N-17BM5TR: Integrated Circuit; Manufacturer_Name: Microchip; Datasheet Link: http://ww1.microchip.com/downloads/en/DeviceDoc/mic2774.pdf; Height: 1.45mm; Manufacturer_Part_Number: MIC2774N-17BM5TR
IC7 IC11 = 74HC163DB,112: Integrated Circuit; Manufacturer_Name: Nexperia; Datasheet Link: https://assets.nexperia.com/documents/data-sheet/74HC_HCT163.pdf; Height: 2mm; Manufacturer_Part_Number: 74HC163DB,112; Mouser Part Number: 771-HC163DB112; Mouser Price/Stock: https://www.mouser.com/Search/Refine.aspx?Keyword=771-HC163DB112; Arrow Part Number: 74HC163DB,112; Arrow Price/Stock: https://www.arrow.com/en/products/74hc163db112/nexperia
IC8 = MIC2774N-29YM5_TR: Integrated Circuit; Manufacturer_Name: Microchip; Manufacturer_Part_Number: MIC2774N-29YM5 TR; Datasheet Link: https://eu.mouser.com/datasheet/2/268/mic2774-1891105.pdf; Height: 1.45mm
IC9 = PCF2129T_2,518: Integrated Circuit; Manufacturer_Name: NXP; Manufacturer_Part_Number: PCF2129T/2,518; Datasheet Link: http://www.nxp.com/docs/en/data-sheet/PCF2129.pdf; Height: 2.65mm; Mouser Part Number: 771-PCF2129T/2,518; Mouser Price/Stock: https://www.mouser.co.uk/ProductDetail/NXP-Semiconductors/PCF2129T-2518/?qs=O0BhuZj9Wkzo98h9NloC7Q%3D%3D; Arrow Part Number: PCF2129T/2,518; Arrow Price/Stock: https://www.arrow.com/en/products/pcf2129t2518/nxp-semiconductors
J1 = USB3076-XX-X_REVC: Micro USB Receptacle, Type B, SMT, Horizontal, Bottom Mount w/out Peg, w/out Shell Stakes, w/out Mating Face Lead-In; MF: {'manufacturer': u'Global Connector Technology'}; Availability: Unavailable; MP: USB3076-XX-X_REVC; Value: *; Price: None; Package: None
J2 = 3221-10-0100-00: Idc Box Header .050" 10pos; MF: {'manufacturer': u'CNC Tech'}; Value: *; Package: None; Price: None; MP: 3221-10-0100-00; Availability: Unavailable
L12 L13 = CMP-06042-006761-1: Multilayer type Inductor for Automotive 120nH ±5% 1.3Ω 200mA 0402; DC Resistance (DCR): 1.3R; Self Resonant Frequency: 600MHz; Test Frequency: 100MHz; Shielding: Unshielded; Q Factor: 8; Max DC Current: 150mA; Core Material: Air; Case/Package: 0402; Packaging: Tape and Reel; Width: 0.5mm; Max Operating Temperature: 125°C; Height: 0.5mm; Min Operating Temperature: -55°C; Tolerance: 5%; Inductance: 120nH; Length: 1mm; Package Quantity: 10000; Termination: SMD/SMT
Q1 = CMP-1058-00775-1: Power MOSFET, 2.8 A, 20 V, N-Channel, 3-Pin SOT-23, Pb-Free, Tape and Reel; Manufacturer: On Semiconductor; Crss Typ (pF): 45; Configuration: Single; V(BR)DSS Min (V): 20; ID Max (A): 2.8; Channel Polarity: N Channel; Ciss Typ (pF): 150; PD Max (W): 1.25; VGS Max (V): 8; Qrr Typ (nC): 200; Coss Typ (pF): 130; VGS(th) Max (V): 1; PartNumber: MGSF2N02ELT1G; ComponentLink3Description: Package Specification; ComponentLink1URL: http://www.onsemi.com/; ComponentLink3URL: http://www.onsemi.cn/pub_link/Collateral/318-08.PDF; DatasheetVersion: Rev. 3; Mounting Technology: Surface Mount; PackageVersion: Rev. AP, 11/2009; PackageDescription: 3-Pin Small Outline Transistor, Body 2.92 x 1.3 mm, Pitch 0.95 mm; ComponentLink1Description: Manufacturer URL; ComponentLink2URL: http://www.onsemi.cn/pub_link/Collateral/MGSF2N02EL-D.PDF; RoHS: Pb-Free; ComponentLink2Description: Datasheet; PackageReference: SOT-23-3-318-08; Package Type: SOT-23-3; Packing: Tape and Reel
R14 R15 = CMP-2002-01183-1: Part Number: ERT-J0ER103J; Manufacturer: Panasonic
R16 R17 R26 R39 R40 R57 R74-R76 R80 = CMP-2002-08276-2: RES Thick Film, 1kΩ, 1%, 0.063W, 100ppm/°C, 0402; Resistance: 1kR; Power Rating: 63mW; Voltage Rating (DC): 50V; Package Quantity: 10; Termination: SMD/SMT; Width: 0.5mm; Military Standard: Not; Length: 1mm; Contact Plating: Tin; Mount: Surface Mount; Packaging: Tape and Reel; Case Code (Imperial): 0402; Tolerance: 1%; Weight: 2.3E-05oz; Number of Pins: 2; Case/Package: 0402; Case Code (Metric): 1005; Lead Free: Lead Free; Number of Terminations: 2; Max Power Dissipation: 63mW; Depth: 0.5mm; Temperature Coefficient: 100ppm/°C; Max Operating Temperature: 155°C; Height: 0.35mm; Features: Automotive AEC-Q200; Composition: Thick Film; Radiation Hardening: No; Voltage Rating: 50V; Min Operating Temperature: -55°C
R18 R22-R24 R31 R36 R41 R50 R51 R63 R64 R66-R71 R73 R78 R81 = CMP-2002-08122-2: RES Thick Film, 0Ω, 0.063W, 0402; Tolerance: 5%; Max Power Dissipation: 63mW; Voltage Rating: 50V; Temperature Coefficient: 100ppm/°C; Resistance: 0mR; Contact Plating: Tin; Height: 0.35mm; Radiation Hardening: No; Features: Automotive AEC-Q200; Composition: Thick Film; Width: 0.5mm; Weight: 2.3E-05oz; Termination: SMD/SMT; Packaging: Tape and Reel; Mount: Surface Mount; Case Code (Metric): 1005; Military Standard: Not; Min Operating Temperature: -55°C; Number of Terminations: 2; Package Quantity: 1; Case Code (Imperial): 0402; Depth: 0.5mm; Max Operating Temperature: 155°C; Case/Package: 0402; Power Rating: 63mW; Lead Free: Lead Free; Voltage Rating (DC): 50V; Length: 1mm
R19-R21 R25 R27-R30 R32 R33 R37 R48 R49 R55 R59 R65 R79 = CMP-2002-00051-3: RES Thick Film, 4.7kΩ, 1%, 0.063W, 100ppm/°C, 0402; Voltage Rating (DC): 50V; Power Rating: 63mW; Resistance: 4.7kR; Termination: SMD/SMT; Military Standard: Not; Length: 1mm; Radiation Hardening: No; Max Operating Temperature: 155°C; Min Operating Temperature: -55°C; Package Quantity: 10; Width: 0.5mm; Case Code (Imperial): 0402; Number of Terminations: 2; Max Power Dissipation: 63mW; Tolerance: 1%; Features: Automotive AEC-Q200; Composition: Thick Film; Depth: 0.5mm; Mount: Surface Mount; Weight: 2.3E-05oz; Lead Free: Lead Free; Case/Package: 0402; Height: 0.35mm; Packaging: Tape and Reel; Temperature Coefficient: 100ppm/°C; Case Code (Metric): 1005; Voltage Rating: 50V; Contact Plating: Tin
R34 R35 R38 R45-R47 = CMP-2002-08136-3: RES Thick Film, 10kΩ, 5%, 0.063W, 200ppm/°C, 0402; Voltage Rating: 50V; Power Rating: 63mW; Resistance: 10kR; Military Standard: Not; Packaging: Tape and Reel; Case Code (Imperial): 0402; Min Operating Temperature: -55°C; Case Code (Metric): 1005; Case/Package: 0402; Temperature Coefficient: 200ppm/°C; Termination: SMD/SMT; Composition: Thick Film; Depth: 0.5mm; Number of Terminations: 2; Contact Plating: Tin; Height: 0.016inch; Width: 0.5mm; Max Operating Temperature: 155°C; Features: Automotive AEC-Q200; Length: 1mm; Radiation Hardening: No; Max Power Dissipation: 63mW; Mount: Surface Mount; Tolerance: 5%; Package Quantity: 1; Weight: 2.3E-05oz
R42-R44 R83 R85 = CMP-2002-01154-4: Chip Resistor, 4.7 KOhm, +/- 1%, 0.1 W, -55 to 155 degC, 0402 (1005 Metric), RoHS, Tape and Reel; PartNumber: ERJ-2RKF4701X; Voltage Rating: 50 V; Case\/Package: 0402; Power Rating: 100 mW; Height: 0.35 mm; Mounting Technology: Surface Mount; REACH SVHC: Yes; Resistance: 4.7 KOhm; Max Operating Temperature: 155 degC; ComponentLink1Description: Manufacturer URL; ComponentLink2Description: Datasheet; Pins: 2; PackageReference: 0402; Tolerance: 1%; Case Code (Imperial): 0402; Length: 1 mm; PackageDescription: 2-Pin Surface Mount Device, Body 1 x 0.5 mm; RoHSCompliant: true; Package Quantity: 1; Radiation Hardening: No; DatasheetVersion: 04/2015; Width: 0.5 mm; Case Code (Metric): 1005; Mount: Surface Mount; ComponentLink1URL: http://www.panasonic.com/; Min Operating Temperature: -55 degC; Packaging: Cut Tape; ComponentLink2URL: http://industrial.panasonic.com/cdbs/www-data/pdf/RDA0000/AOA0000C86.pdf
R52 R53 = CMP-1011-00363-3: RES Thick Film, 49.9Ω, 1%, 0.063W, 100ppm/°C, 0402; Resistance: 49.9R; Voltage Rating: 50V; Power Rating: 63mW; Temperature Coefficient: 100ppm/°C; Packaging: Tape and Reel; Height: 0.35mm; Length: 1mm; Case Code (Metric): 1005; Weight: 2.3E-05oz; Case Code (Imperial): 0402; Voltage Rating (DC): 50V; Composition: Thick Film; Lead Free: Lead Free; Package Quantity: 10; Number of Terminations: 2; Width: 0.5mm; Max Operating Temperature: 155°C; Depth: 0.5mm; Max Power Dissipation: 63mW; Tolerance: 1%; Radiation Hardening: No; Features: Automotive AEC-Q200; Min Operating Temperature: -55°C; Contact Plating: Tin; Mount: Surface Mount; Military Standard: Not; Termination: SMD/SMT; Case/Package: 0402
R54 R56 = CMP-2002-08532-1: Part Number: CRCW040233R2FKED; Manufacturer: Vishay Dale
R58 = CMP-2002-08523-2: RES Thick Film, 330Ω, 1%, 0.063W, 100ppm/°C, 0402; Max Power Dissipation: 63mW; Voltage Rating (DC): 50V; Resistance: 330R; Case/Package: 0402; Packaging: Tape and Reel; Width: 0.5mm; Case Code (Metric): 1005; Radiation Hardening: No; Military Standard: Not; Contact Plating: Tin; Temperature Coefficient: 100ppm/°C; Lead Free: Lead Free; Power Rating: 63mW; Voltage Rating: 50V; Tolerance: 1%; Features: Automotive AEC-Q200; Case Code (Imperial): 0402; Composition: Thick Film; Weight: 2.3E-05oz; Package Quantity: 10; Min Operating Temperature: -55°C; Height: 0.35mm; Length: 1mm; Termination: SMD/SMT; Number of Terminations: 2; Depth: 0.5mm; Max Operating Temperature: 155°C
R60 R61 R72 R77 = CMP-2002-00270-2: RES Thick Film, 91kΩ, 1%, 0.063W, 100ppm/°C, 0402; Power Rating: 63mW; Voltage Rating: 50V; Resistance: 91kR; Packaging: Tape and Reel; Max Operating Temperature: 155°C; Height: 0.35mm; Radiation Hardening: No; Tolerance: 1%; Number of Terminations: 2; Width: 0.02inch; Length: 1mm; Temperature Coefficient: 100ppm/°C; Features: Automotive AEC-Q200; Voltage Rating (DC): 50V; Weight: 2.3E-05oz; Min Operating Temperature: -55°C; Military Standard: Not; Max Power Dissipation: 63mW; Number of Pins: 2; Composition: Thick Film; Lead Free: Lead Free; Contact Plating: Tin; Case/Package: 0402; Termination: SMD/SMT; Package Quantity: 10; Case Code (Metric): 1005; Case Code (Imperial): 0402; Depth: 0.5mm
R62 = CMP-2002-08143-1: Part Number: CRCW040210R0FKED; Manufacturer: Vishay Dale
R82 = CMP-2002-08529-1: Manufacturer: Vishay Dale; Part Number: CRCW040233K2FKED
R84 R86 = CMP-2000-00435-2: Chip Resistor, 330 Ohm, +/- 1%, 0.1 W, -55 to 155 degC, 0603 (1608 Metric), RoHS, Tape and Reel; Gender: Male; Mating Cycles: 10000; Current Rating: 500 mA; Voltage Rating: 10 V; REACH SVHC: No SVHC; PackageDescription: 2-Pin Surface Mount Device, Body 1.6 x 0.85 mm; Contact Finish: Gold; Pins: 8; ComponentLink1Description: Manufacturer URL; Packaging: Tape and Reel; Max Operating Temperature: 85 degC; Contact Material: Copper; Height: 1.45 mm; Width: 1.45 mm; DatasheetVersion: Apr-15; Package Quantity: 1500; Contact Plating: Gold; PackageReference: 0603; Mount: Surface Mount; Lead Pitch: 1.1 mm; Min Operating Temperature: -25 degC; ComponentLink1URL: http://www.panasonic.com/; ComponentLink2URL: http://industrial.panasonic.com/cdbs/www-data/pdf/RDA0000/AOA0000C86.pdf; Length: 13.7 mm; ComponentLink2Description: Datasheet; RoHSCompliant: true
SW1 = CMP-2000-06884-2: SWITCH SLIDE SPDT 300MA 6V; Actuator Material: Nylon; Switch Function: On-On; Insulation Resistance: 100mR; Actuator Type: Standard; Mechanical Life: 10000Cycles; Actuator Length: 1.5mm; Contact Resistance: 70mR; Min Operating Temperature: -20°C; Max Current Rating: 300mA; Max Voltage Rating (DC): 6V; Package Quantity: 1; Mount: Surface Mount; Packaging: Tape and Reel; Contact Plating: Silver; Depth: 5mm; REACH SVHC: No SVHC; Voltage Rating (DC): 6V; Voltage Rating (AC): 6V; Max Operating Temperature: 85°C; Length: 7.7mm; Termination: Gull Wing; Current Rating: 300mA; Contact Current Rating: 300mA; Orientation: Right Angle; Width: 6.7mm; Switch Travel: 1.5mm; Lead Free: Lead Free; Contact Material: Copper Alloy; Throw Configuration: SPDT
U1 U2 = CMP-0859-00406-3: Single Buffer/Driver With Open-Drain Output, DCK0005A, SMALL T&R; Manufacturer: Texas Instruments; Input Type: CMOS; F @ Nom Voltage(Max)(Mhz): 250; Rating: Catalog; Bits(#): 1; Schmitt Trigger: No; VCC(Min)(V): 0.8; tpd @ Nom Voltage(Max)(ns): 4.7,3.3,2.4,2.3,1.8; Output Drive (IOL/IOH)(Max)(mA): 9/-9; VCC(Max)(V): 2.7; Technology Family: AUC; ICC @ Nom Voltage(Max)(mA): 0.01; Voltage(Nom)(V): 0.8,1.2,1.5,1.8,2.5; Sub-Family: Non-Inverting Buffer/Driver; Logic: True; DatasheetVersion: SCES373Q; 3-State Output: No; Operating Temperature Range(C): -40 to 85; Generic Part Number: SN74AUC1G07; PackageReference: DCK0005A; Output Type: CMOS
U3 = CMP-0859-00960-3: Single Buffer/Driver With Open-Drain Output, DSF0006A, LARGE T&R; Manufacturer: Texas Instruments; Output Type: CMOS; 3-State Output: No; F @ Nom Voltage(Max)(Mhz): 150; Bits(#): 1; Rating: Catalog; Voltage(Nom)(V): 1.8,2.5,3.3,5; Sub-Family: Non-Inverting Buffer/Driver; Input Type: CMOS/TTL; VCC(Max)(V): 5.5; Logic: True; VCC(Min)(V): 1.65; Output Drive (IOL/IOH)(Max)(mA): 32/-32; ICC @ Nom Voltage(Max)(mA): 0.01; Technology Family: LVC; tpd @ Nom Voltage(Max)(ns): 8.6,6,4.7,4; Schmitt Trigger: No; Operating Temperature Range(C): -40 to 125,-40 to 85; DatasheetVersion: SCES296AC; Generic Part Number: SN74LVC1G07; PackageReference: DSF0006A
Y1 = ECS-3518-1000-B-TR: subminiature SMD oscillators; MF: {'manufacturer': u'ECS Inc.'}; Price: None; MP: ECS-3518-1000-B-TR; Availability: Unavailable; Value: *; Package: None
Y2 = ASVMB-2.048MHZ-ER-T: Crystal or Oscillator; Manufacturer_Name: ABRACON; Datasheet Link: https://abracon.com/Oscillators/ASVMB.pdf; Height: 0.9mm; Manufacturer_Part_Number: ASVMB-2.048MHZ-ER-T

## Sheet Public_CPU_IO.SchDoc
size D
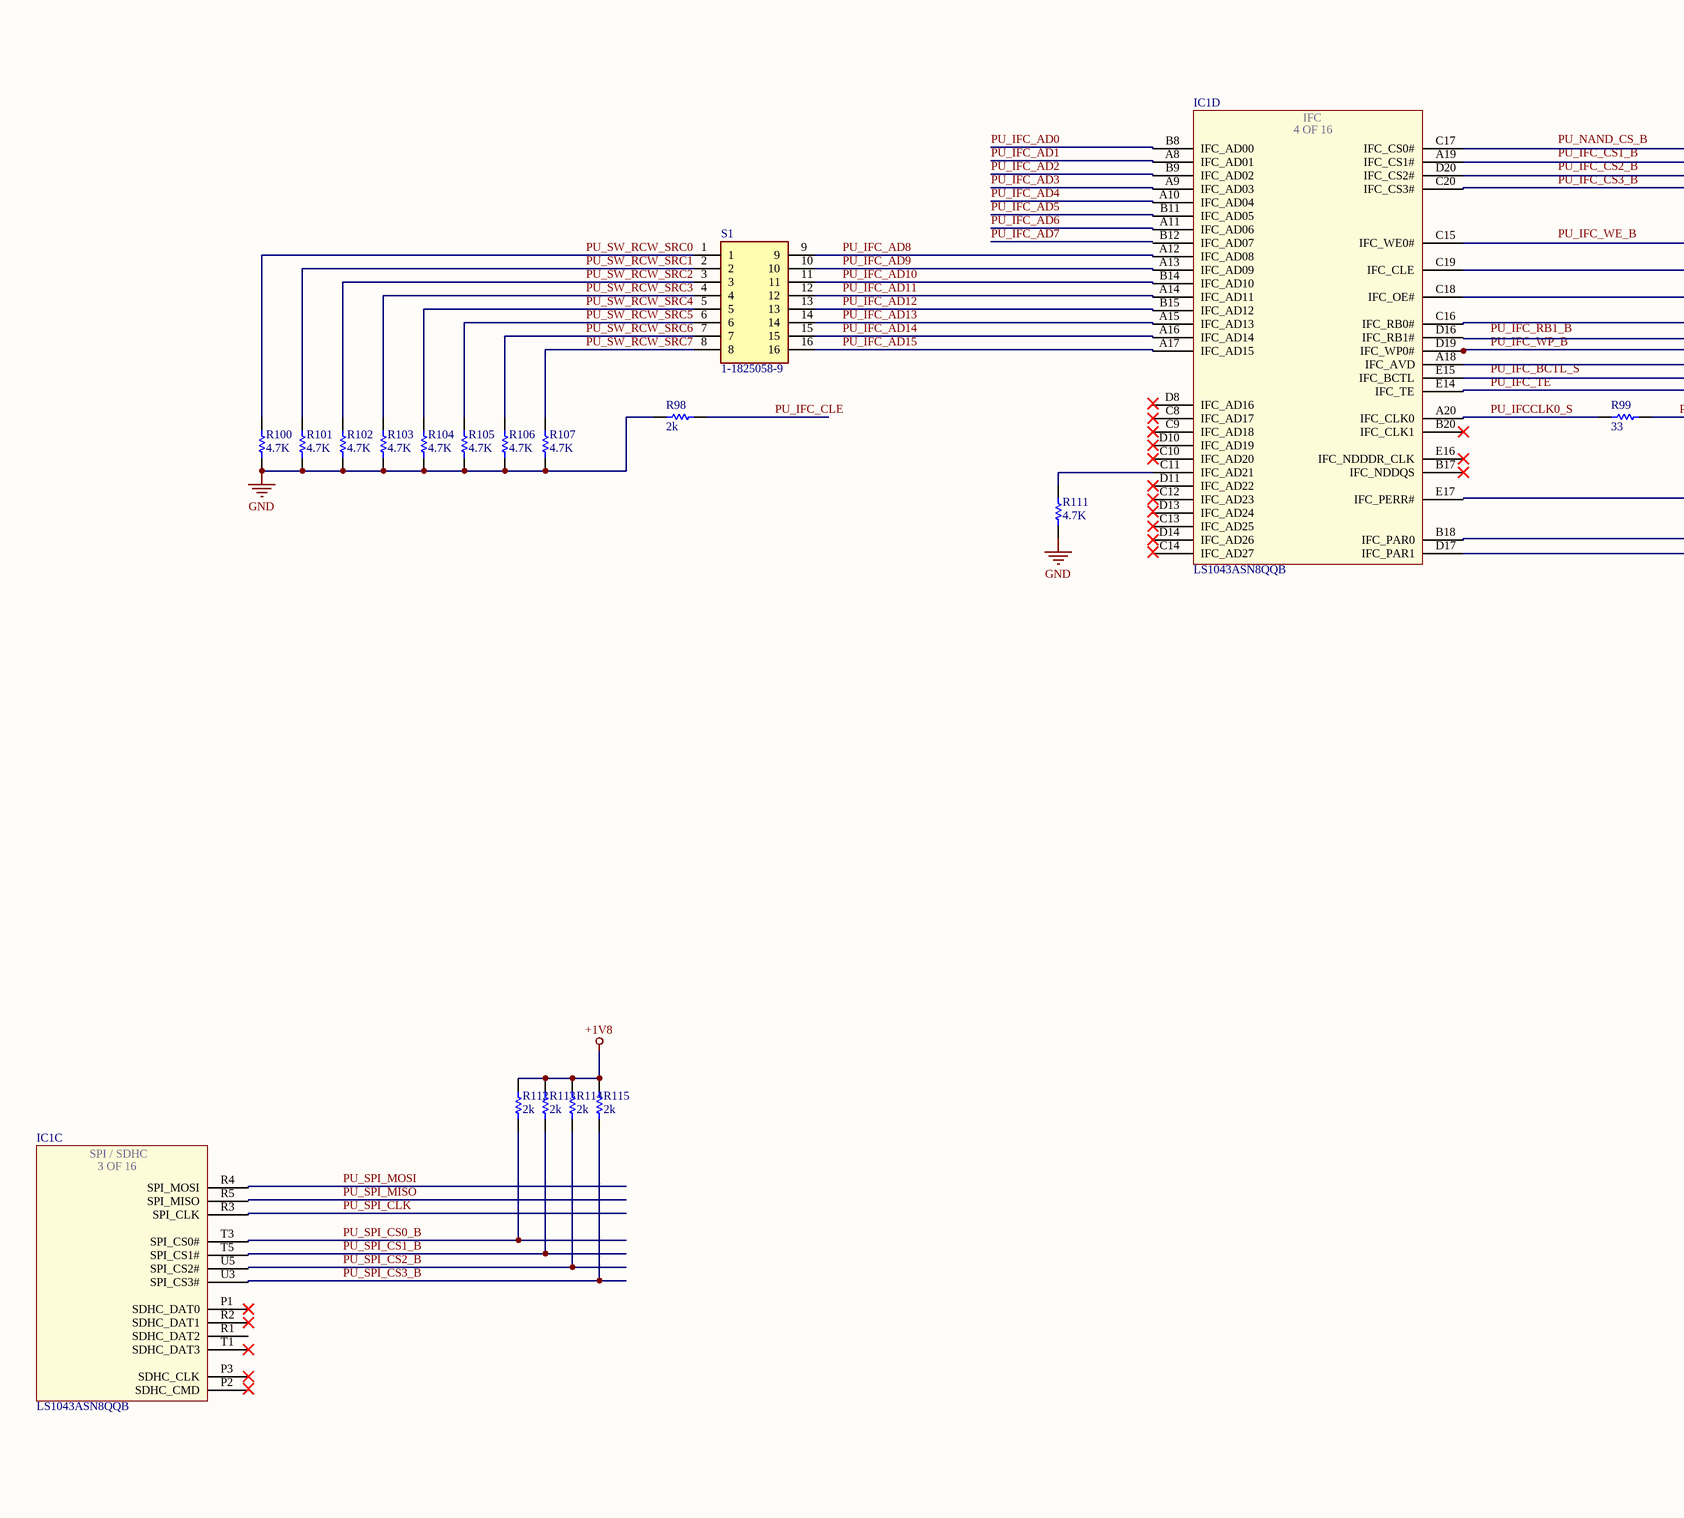
[diagram p11: Public_CPU_IO.SchDoc, left]
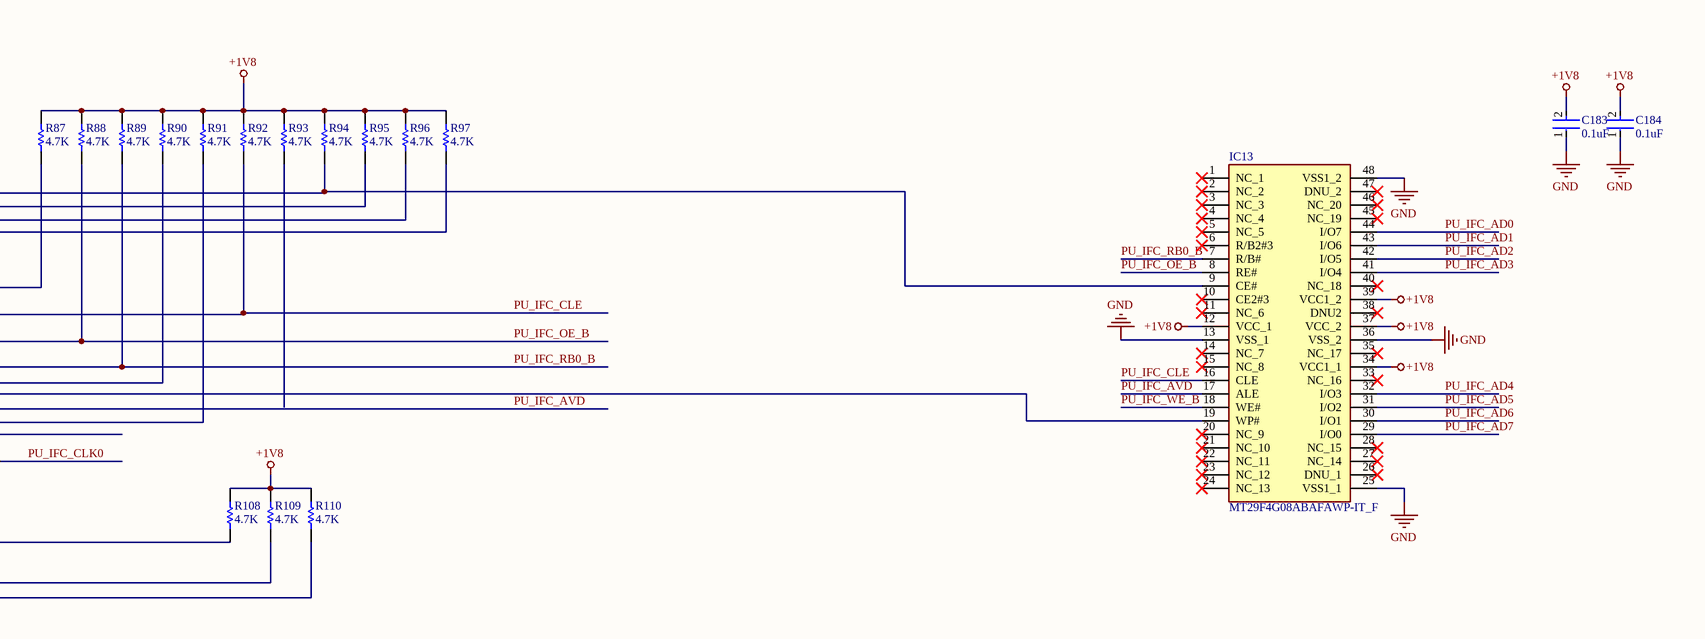
[diagram p12: Public_CPU_IO.SchDoc, right]

### Parts
C183  0.1uF  [FP-GRM15-MFG]
C184  0.1uF  [FP-GRM15-MFG]
IC1  LS1043ASN8QQB  [BGA780C80P28X28_2300X2300X261]  (parts C,D of 16)
IC13  MT29F4G08ABAFAWP-IT_F  [SOP50P2000X120-48N]
R87  4.7K  [RESC1005X40X25LL05T05]
R88  4.7K  [RESC1005X40X25LL05T05]
R89  4.7K  [RESC1005X40X25LL05T05]
R90  4.7K  [RESC1005X40X25LL05T05]
R91  4.7K  [RESC1005X40X25LL05T05]
R92  4.7K  [RESC1005X40X25LL05T05]
R93  4.7K  [RESC1005X40X25LL05T05]
R94  4.7K  [RESC1005X40X25LL05T05]
R95  4.7K  [RESC1005X40X25LL05T05]
R96  4.7K  [RESC1005X40X25LL05T05]
R97  4.7K  [RESC1005X40X25LL05T05]
R98  2k  [RESC1005X40X25NL05T05]
R99  33  [RESC1005X40X25LL05T05]
R100  4.7K  [RESC1005X40X25LL05T05]
R101  4.7K  [RESC1005X40X25LL05T05]
R102  4.7K  [RESC1005X40X25LL05T05]
R103  4.7K  [RESC1005X40X25LL05T05]
R104  4.7K  [RESC1005X40X25LL05T05]
R105  4.7K  [RESC1005X40X25LL05T05]
R106  4.7K  [RESC1005X40X25LL05T05]
R107  4.7K  [RESC1005X40X25LL05T05]
R108  4.7K  [RESC1005X40X25LL05T05]
R109  4.7K  [RESC1005X40X25LL05T05]
R110  4.7K  [RESC1005X40X25LL05T05]
R111  4.7K  [RESC1005X40X25LL05T05]
R112  2k  [RESC1005X40X25NL05T05]
R113  2k  [RESC1005X40X25NL05T05]
R114  2k  [RESC1005X40X25NL05T05]
R115  2k  [RESC1005X40X25NL05T05]
S1  1-1825058-9  [118250589]

### Nets
+1V8: C183.2 C184.2 IC13.12(VCC_1) IC13.34(VCC1_1) IC13.37(VCC_2) IC13.39(VCC1_2) R87.2 R88.2 R89.2 R90.2 R91.2 R92.2 R93.2 R94.2 R95.2 R96.2 R97.2 R108.2 R109.2 R110.2 R112.1 R113.1 R114.1 R115.1
GND: C183.1 C184.1 IC13.13(VSS_1) IC13.25(VSS1_1) IC13.36(VSS_2) IC13.48(VSS1_2) R98.2 R100.1 R101.1 R102.1 R103.1 R104.1 R105.1 R106.1 R107.1 R111.1
PU_IFC_AD0: IC1.B8(IFC_AD00) IC13.44(I/O7)
PU_IFC_AD1: IC1.A8(IFC_AD01) IC13.43(I/O6)
PU_IFC_AD2: IC1.B9(IFC_AD02) IC13.42(I/O5)
PU_IFC_AD3: IC1.A9(IFC_AD03) IC13.41(I/O4)
PU_IFC_AD4: IC1.A10(IFC_AD04) IC13.32(I/O3)
PU_IFC_AD5: IC1.B11(IFC_AD05) IC13.31(I/O2)
PU_IFC_AD6: IC1.A11(IFC_AD06) IC13.30(I/O1)
PU_IFC_AD7: IC13.29(I/O0)
PU_IFC_AD8: IC1.A12(IFC_AD08) S1.9
PU_IFC_AD9: IC1.A13(IFC_AD09) S1.10
PU_IFC_AD10: IC1.B14(IFC_AD10) S1.11
PU_IFC_AD11: IC1.A14(IFC_AD11) S1.12
PU_IFC_AD12: IC1.B15(IFC_AD12) S1.13
PU_IFC_AD13: IC1.A15(IFC_AD13) S1.14
PU_IFC_AD14: IC1.A16(IFC_AD14) S1.15
PU_IFC_AD15: IC1.A17(IFC_AD15) S1.16
PU_IFC_AVD: IC1.A18(IFC_AVD) IC13.17(ALE)
PU_IFC_CLE: IC1.C19(IFC_CLE) IC13.16(CLE) R92.1 R98.1
PU_IFC_CLK0: R99.2
PU_IFC_CS3_B: IC1.C20(IFC_CS3#) R97.1
PU_IFC_OE_B: IC1.C18(IFC_OE#) IC13.8(RE#) R88.1
PU_IFC_RB0_B: IC1.C16(IFC_RB0#) IC13.7(R/B#) R89.1
PU_IFC_TE: IC1.E14(IFC_TE)
PU_IFC_WE_B: IC13.18(WE#)
PU_IFC_WP_B: IC1.D19(IFC_WP0#) IC13.19(WP#)
PU_IFCCLK0_S: IC1.A20(IFC_CLK0) R99.1
PU_SPI_CLK: IC1.R3(SPI_CLK)
PU_SPI_CS0_B: IC1.T3(SPI_CS0#) R112.2
PU_SPI_CS1_B: IC1.T5(SPI_CS1#) R113.2
PU_SPI_CS2_B: R114.2
PU_SPI_CS3_B: IC1.U3(SPI_CS3#) R115.2
PU_SPI_MOSI: IC1.R4(SPI_MOSI)
PU_SW_RCW_SRC0: R100.2 S1.1
PU_SW_RCW_SRC1: R101.2 S1.2
PU_SW_RCW_SRC2: R102.2 S1.3
PU_SW_RCW_SRC3: R103.2 S1.4
PU_SW_RCW_SRC4: R104.2 S1.5
PU_SW_RCW_SRC5: R105.2 S1.6
PU_SW_RCW_SRC6: R106.2 S1.7
PU_SW_RCW_SRC7: R107.2 S1.8
NetIC1_A19: IC1.A19(IFC_CS1#) R95.1
NetIC1_B18: IC1.B18(IFC_PAR0) R109.1
NetIC1_C11: IC1.C11(IFC_AD21) R111.2
NetIC1_C15: IC1.C15(IFC_WE0#) R87.1
NetIC1_C17: IC1.C17(IFC_CS0#) IC13.9(CE#) R94.1
NetIC1_D17: IC1.D17(IFC_PAR1) R110.1
NetIC1_D20: IC1.D20(IFC_CS2#) R96.1
NetIC1_E15: IC1.E15(IFC_BCTL) R91.1

Not connected (* = marked no-connect by the designer): IC1 B12(IFC_AD07) B17(IFC_NDDQS)* B20(IFC_CLK1)* C8(IFC_AD17)* C9(IFC_AD18)* C10(IFC_AD20)* C12(IFC_AD23)* C13(IFC_AD25)* C14(IFC_AD27) D8(IFC_AD16) D10(IFC_AD19)* D11(IFC_AD22)* D13(IFC_AD24) D14(IFC_AD26)* D16(IFC_RB1#) E16(IFC_NDDDR_CLK)* E17(IFC_PERR#) P1(SDHC_DAT0)* P2(SDHC_CMD) P3(SDHC_CLK)* R1(SDHC_DAT2) R2(SDHC_DAT1)* R5(SPI_MISO) T1(SDHC_DAT3)* U5(SPI_CS2#); IC13 1(NC_1)* 2(NC_2)* 3(NC_3)* 4(NC_4)* 5(NC_5)* 6(R/B2#3)* 10(CE2#3)* 11(NC_6)* 14(NC_7)* 15(NC_8)* 20(NC_9)* 21(NC_10)* 22(NC_11)* 23(NC_12)* 24(NC_13)* 26(DNU_1)* 27(NC_14)* 28(NC_15)* 33(NC_16)* 35(NC_17)* 38(DNU2)* 40(NC_18)* 45(NC_19)* 46(NC_20)* 47(DNU_2)*; R90 1; R93 1; R108 1

### Notes on the sheet
- Labels drawn without touching a wire or pin: PU_IFC_BCTL_S, PU_IFC_CS1_B, PU_IFC_CS2_B, PU_IFC_RB1_B, PU_IFC_WE_B, PU_NAND_CS_B
- Title
- Size:
- Date:
- File:
- D
- Number:
- Time:
- Revision:
- Sheet
- of
- (in symbol LS1043ASN8QQB, part C) SPI / SDHC; 3 OF 16
- (in symbol LS1043ASN8QQB, part D) IFC; 4 OF 16

### Library data of the parts
C183 C184 = CMP-2100-03641-2: as C160 on sheet Public_CPU_Reset_IO; RoHS: TRUE; Temperature Characteristic: X7R; Octopart: https://octopart.com/grm155r71c104ka88d-murata-196880; Digikey Description: CAP CER 0.1UF 16V X7R 0402; Device Class L3: Ceramic Capacitors; Height: 0.55mm; ComponentLink2Description: Datasheet; Temperature Range Low: -55°C; Ipc Land Pattern Name: CAPC10050X219; ComponentLink2URL: https://search.murata.co.jp/Ceramy/image/img/A01X/G101/ENG/GRM155R71H471KA01-01A.pdf; Device Class L1: Passive Components; Lead Free: yes; Category: Cap; Package: GRM15; Temperature: -55°C to +125°C; Device Class L2: Capacitors; Temperature Range High: +125°C; Mouser Description: 0402 0.1 uF 16V ±10 % Tolerance X7R SMT Multilayer Ceramic Capacitor
IC1 = LS1043ASN8QQB: as IC1 on sheet Public_CPU_Reset_IO; Datasheet Link: http://www.nxp.com/secured/assets/documents/en/data-sheet/LS1088A.pdf; Height: 2.61mm; Manufacturer_Part_Number: LS1043ASN8QQB; Mouser Part Number: 771-LS1043ASN8QQB; Mouser Price/Stock: https://www.mouser.co.uk/ProductDetail/NXP-Semiconductors/LS1043ASN8QQB/?qs=AQlKX63v8RsTATOTx7X0Jg%3D%3D
IC13 = MT29F4G08ABAFAWP-IT_F: Integrated Circuit; Manufacturer_Name: Micron; Manufacturer_Part_Number: MT29F4G08ABAFAWP-IT:F; Datasheet Link: https://componentsearchengine.com/Datasheets/2/MT29F4G08ABAFAWP-IT_F.pdf; Height: 1.2mm; Mouser Part Number: 340-371016-TRAY; Mouser Price/Stock: https://www.mouser.co.uk/ProductDetail/Micron/MT29F4G08ABAFAWP-ITF/?qs=0lSvoLzn4L9J4k7jmg5qkQ%3D%3D; Arrow Part Number: MT29F4G08ABAFAWP-IT:F; Arrow Price/Stock: https://www.arrow.com/en/products/mt29f4g08abafawp-itf/micron-technology
R87-R97 R100-R111 = CMP-2002-01154-4: as R42-R44 on sheet Public_CPU_Reset_IO; Height: 0.35 mm; Mounting Technology: Surface Mount; REACH SVHC: Yes; Resistance: 4.7 KOhm; Max Operating Temperature: 155 degC; ComponentLink1Description: Manufacturer URL; ComponentLink2Description: Datasheet; Pins: 2; PackageReference: 0402; Tolerance: 1%; Case Code (Imperial): 0402; Length: 1 mm; PackageDescription: 2-Pin Surface Mount Device, Body 1 x 0.5 mm; RoHSCompliant: true; Package Quantity: 1; Radiation Hardening: No; DatasheetVersion: 04/2015; Width: 0.5 mm; Case Code (Metric): 1005; Mount: Surface Mount; ComponentLink1URL: http://www.panasonic.com/; Min Operating Temperature: -55 degC; Packaging: Cut Tape; ComponentLink2URL: http://industrial.panasonic.com/cdbs/www-data/pdf/RDA0000/AOA0000C86.pdf
R98 R112-R115 = CMP-2002-00758-3: Chip Resistor, 2 KOhm, +/- 1%, 100 mW, -55 to 155 degC, 0402 (1005 Metric), RoHS, Tape and Reel; Manufacturer: Basic Passives; PartNumber: ERJ-2RKF2001X; Power Rating: 100 mW; Voltage Rating: 50 V; Case\/Package: 0402; Resistance: 2 KOhm; Packaging: Tape and Reel; Tolerance: 1%; PackageReference: 0402; Package Quantity: 10000; ComponentLink1URL: http://www.panasonic.com/; Min Operating Temperature: -55 degC; DatasheetVersion: 04/2015; Case Code (Imperial): 0402; PackageDescription: 2-Pin Surface Mount Device, Body 1 x 0.5 mm; Height: 0.35 mm; Pins: 2; Mount: Surface Mount; Radiation Hardening: No; ComponentLink1Description: Manufacturer URL; ComponentLink2Description: Datasheet; Max Operating Temperature: 155 degC; Case Code (Metric): 1005; Length: 1 mm; RoHSCompliant: true; Mounting Technology: Surface Mount; Width: 0.5 mm; ComponentLink2URL: http://industrial.panasonic.com/cdbs/www-data/pdf/RDA0000/AOA0000C86.pdf; REACH SVHC: Unknown
R99 = CMP-2002-01146-1: Manufacturer: Panasonic; Part Number: ERJ2RKF33R0X
S1 = 1-1825058-9: Switch; Manufacturer_Name: TE Connectivity; Datasheet Link: http://www.te.com/commerce/DocumentDelivery/DDEController?Action=showdoc&DocId=Customer+Drawing%7F1825058%7FS4%7Fpdf%7FEnglish%7FENG_CD_1825058_S4.pdf%7F1-1825058-9; Height: 3mm; Manufacturer_Part_Number: 1-1825058-9; Arrow Part Number: 1-1825058-9; Arrow Price/Stock: https://www.arrow.com/en/products/1-1825058-9/te-connectivity